# EAGLE schematic C9 (EAGLE 7.5.0)

## Sheet 1 of 4: Core1/4
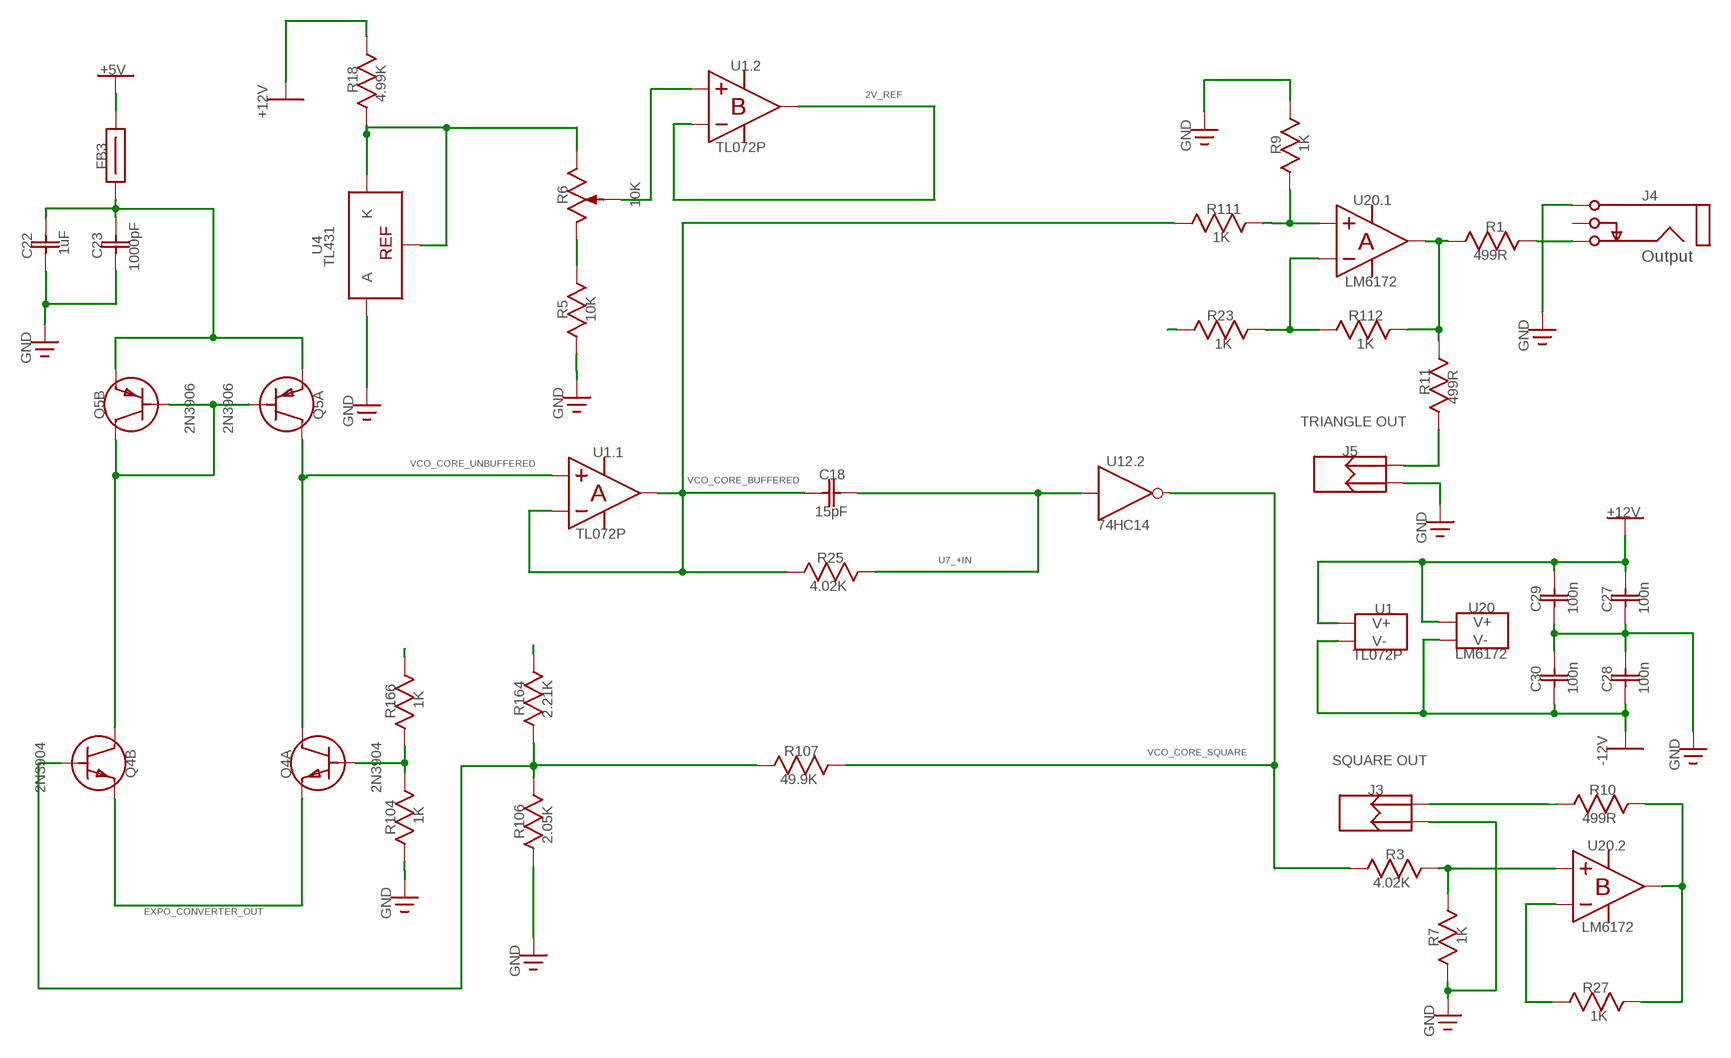
[diagram p0: schematic, sheet 1]

### Parts
C18  15pF  CAP100  [CAP-2.54/6.6X3]
C22  1uF  CAP100  [CAP-2.54/6.6X3]
C23  1000pF  CAP100  [CAP-2.54/6.6X3]
C27  100n  CAP100  [CAP-2.54/6.6X3]
C28  100n  CAP100  [CAP-2.54/6.6X3]
C29  100n  CAP100  [CAP-2.54/6.6X3]
C30  100n  CAP100  [CAP-2.54/6.6X3]
FB3  68R  2743001111  [FB-10.16/4.45X3.5]
J3  90131-0121  [HDR-2X1T/2.54X2.54/3X5]
J4  PJ302M_2  [PJ302M]
J5  90131-0121  [HDR-2X1T/2.54X2.54/3X5]
Q4A  2N3904  [TO-92]
Q4B  2N3904_11  [TO-92]
Q5A  2N3906_5  [TO-92]
Q5B  2N3906  [TO-92]
R1  499R  RES300  [RES-7.62/5.1X2.5]
R3  4.02K  RES300  [RES-7.62/5.1X2.5]
R5  10K  RES300  [RES-7.62/5.1X2.5]
R6  10K  3362P  [3362P]
R7  1K  RES300  [RES-7.62/5.1X2.5]
R9  1K  RES300  [RES-7.62/5.1X2.5]
R10  499R  RES300  [RES-7.62/5.1X2.5]
R11  499R  RES300  [RES-7.62/5.1X2.5]
R18  4.99K  RES300  [RES-7.62/5.1X2.5]
R23  1K  RES300  [RES-7.62/5.1X2.5]
R25  4.02K  RES300  [RES-7.62/5.1X2.5]
R27  1K  RES300  [RES-7.62/5.1X2.5]
R104  1K  RES300  [RES-7.62/5.1X2.5]
R106  2.05K  RES300  [RES-7.62/5.1X2.5]
R107  49.9K  RES300  [RES-7.62/5.1X2.5]
R111  1K  RES300  [RES-7.62/5.1X2.5]
R112  1K  RES300  [RES-7.62/5.1X2.5]
R164  2.21K  RES300  [RES-7.62/5.1X2.5]
R166  1K  RES300  [RES-7.62/5.1X2.5]
U1  TL072P  [DIP-8]
U4  TL431  [TO-92-100R]
U12  74HC14  [DIP-14]
U20  LM6172  [DIP-8]

### Nets
0V: C22.2 C23.2 C27.2 C28.1 C29.2 C30.1 J3.2 J4.1A(Sleeve) J4.1B(Sleeve) J5.2 R5.2(B) R7.1(A) R9.2(B) R104.1(A) R106.1(A) U4.2(A) ; supply symbol labelled GND ; also sheet 2,3,4
2V_REF: R23.1(A) R164.2(B) R166.2(B) U1.6(PART_2:IN-) U1.7(PART_2:OUT) ; also sheet 2,3
+5V: FB3.2 ; also sheet 3,4
+12V: C27.1 C29.1 R18.2(B) U1.8(VCC_AND_GND:V+) U20.8(VCC_AND_GND:V+) ; also sheet 2,4
-12V: C28.2 C30.2 U1.4(VCC_AND_GND:V-) U20.4(VCC_AND_GND:V-) ; also sheet 2,4
EXPO_CONVERTER_OUT: Q4A.1(E) Q4B.1(E) ; also sheet 2
Net_0: J4.3A(Tip) J4.3B(Tip) R1.2(B)
Net_1: R6.3(CW) R18.1(A) U4.1(K) U4.3(REF)
Net_5: R9.1(A) R111.2(B) U20.3(PART_1:IN+)
Net_7: R3.2(B) R7.2(B) U20.5(PART_2:IN+)
Net_8: J3.1 R10.1(A)
Net_16: R5.1(A) R6.1(CCW)
Net_19: R10.2(B) R27.2(B) U20.7(PART_2:OUT)
Net_21: R6.2(W) U1.5(PART_2:IN+)
Net_36: J5.1 R11.1(A)
Net_79: Q4B.3(C) Q5A.2(B) Q5B.2(B) Q5B.3(C)
Net_81: Q4A.2(B) R104.2(B) R166.1(A)
Net_85: Q4B.2(B) R106.2(B) R107.1(A) R164.1(A)
Net_101: R23.2(B) R112.1(A) U20.2(PART_1:IN-)
Net_103: C22.1 C23.1 FB3.1 Q5A.1(E) Q5B.1(E)
Net_178: R27.1(A) U20.6(PART_2:IN-)
PROCESSOR_IN: R1.1(A) R11.2(B) R112.2(B) U20.1(PART_1:OUT)
U7_+IN: C18.1 R25.2(B) U12.3(PART_2:A) ; also sheet 3
VCO_CORE_BUFFERED: C18.2 R25.1(A) R111.1(A) U1.1(PART_1:OUT) U1.2(PART_1:IN-)
VCO_CORE_SQUARE: R3.1(A) R107.2(B) U12.4(PART_2:Y)
VCO_CORE_UNBUFFERED: Q4A.3(C) Q5A.3(C) U1.3(PART_1:IN+) ; also sheet 3
Unconnected: J4.2A(Switch) J4.2B(Switch)

### Notes on the sheet
- +5V | U1.2
- R18 | 2V_REF
- B
- 4.99K
- +12V
- TL072P
- GND | R9 | 1K
- FB3
- R6 | J4
- 10K | U20.1
- R111
- 1K | A | R1
- 499R | Output
- 1uF | U4
- C22 | C23 | REF
- 1000pF | TL431
- LM6172
- R5 | 10K | R23 | R112
- 1K | 1K
- GND
- GND
- R11
- 499R
- Q5B | Q5A | GND | TRIANGLE OUT
- GND
- 2N3906 | 2N3906
- U1.1 | J5
- VCO_CORE_UNBUFFERED
- U12.2
- VCO_CORE_BUFFERED
- C18
- A
- 15pF
- 74HC14 | +12V
- TL072P
- GND
- U7_+IN
- R25
- 4.02K
- U1 | U20 | C29 | 100n | C27 | 100n
- TL072P | LM6172
- C30 | 100n | C28 | 100n
- 1K
- R166 | R164 | 2.21K
- VCO_CORE_SQUARE
- R107 | SQUARE OUT
- -12V
- 49.9K | GND
- Q4B | Q4A
- 2N3904 | 2N3904 | J3 | R10
- 499R
- 1K
- R104 | R106
- 2.05K
- U20.2
- R3
- 4.02K | B
- EXPO_CONVERTER_OUT
- GND | LM6172
- R7 | 1K
- GND
- R27
- 1K
- GND

## Sheet 2 of 4: Expo2/4
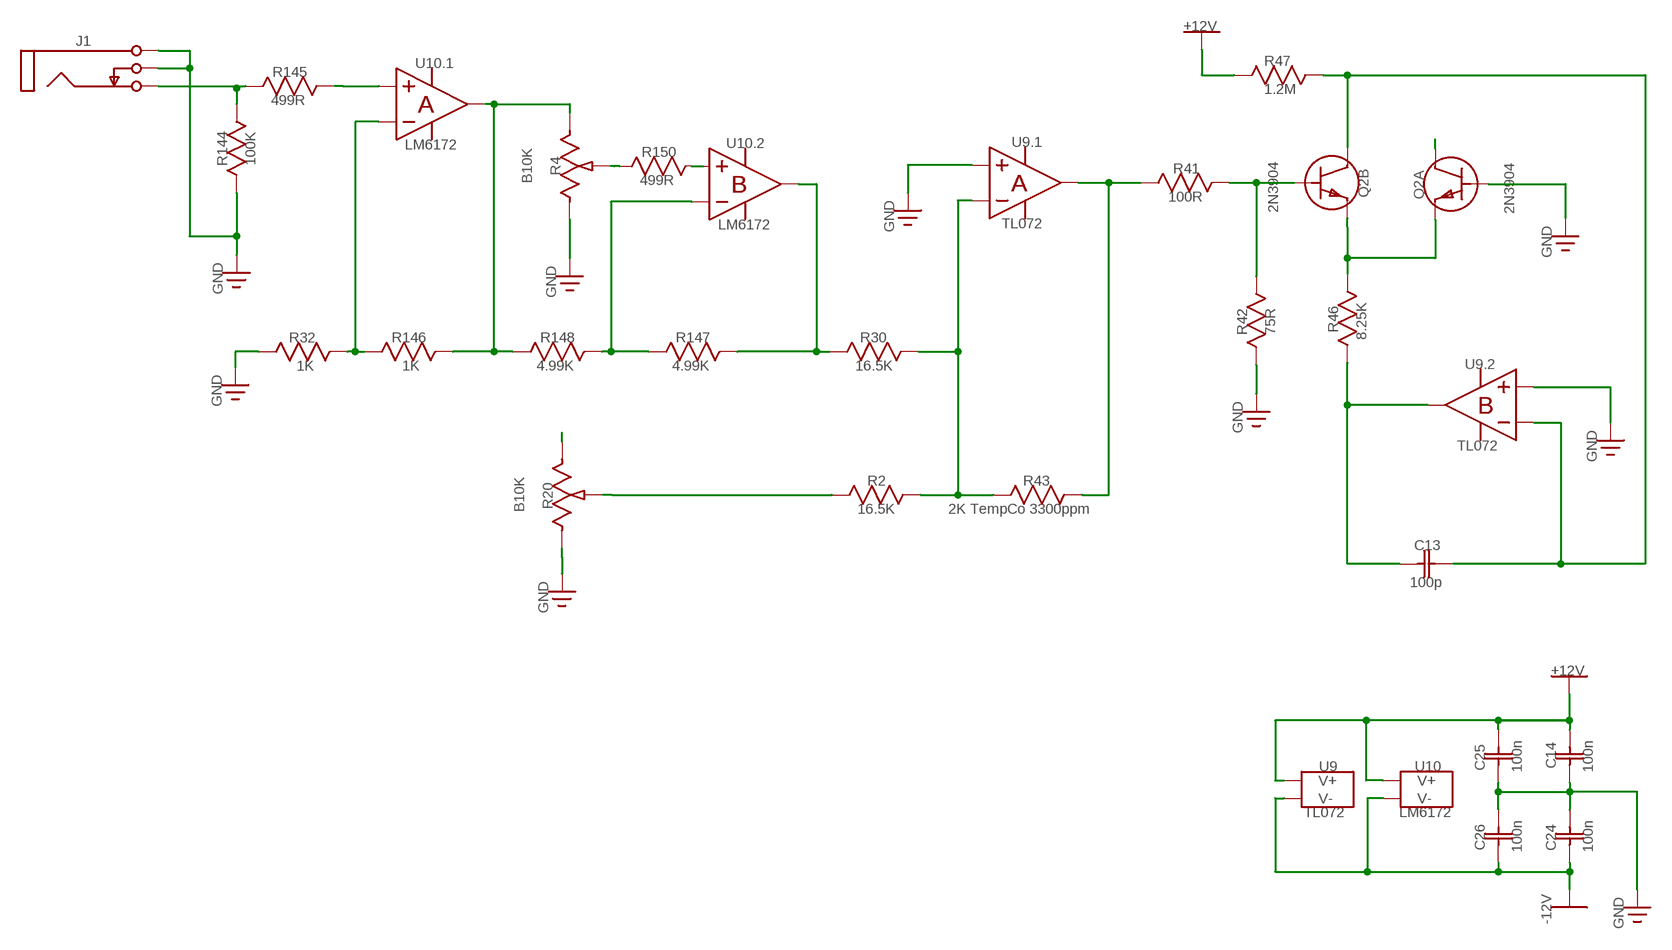
[diagram p1: schematic, sheet 2]

### Parts
C13  100p  CAP100  [CAP-2.54/6.6X3]
C14  100n  CAP100  [CAP-2.54/6.6X3]
C24  100n  CAP100  [CAP-2.54/6.6X3]
C25  100n  CAP100  [CAP-2.54/6.6X3]
C26  100n  CAP100  [CAP-2.54/6.6X3]
J1  PJ302M  [PJ302M]
Q2A  2N3904  [TO-92]
Q2B  2N3904_11  [TO-92]
R2  16.5K  RES300  [RES-7.62/5.1X2.5]
R4  B10K  ALPHA9H  [ALPHA9H]
R20  B10K  ALPHA9H  [ALPHA9H]
R30  16.5K  RES300  [RES-7.62/5.1X2.5]
R32  1K  RES300  [RES-7.62/5.1X2.5]
R41  100R  RES300  [RES-7.62/5.1X2.5]
R42  75R  RES300  [RES-7.62/5.1X2.5]
R43  2K TempCo 3300ppm  RES300  [RES-7.62/5.1X2.5]
R46  8.25K  RES300  [RES-7.62/5.1X2.5]
R47  1.2M  RES300  [RES-7.62/5.1X2.5]
R144  100K  RES300  [RES-7.62/5.1X2.5]
R145  499R  RES300  [RES-7.62/5.1X2.5]
R146  1K  RES300  [RES-7.62/5.1X2.5]
R147  4.99K  RES300  [RES-7.62/5.1X2.5]
R148  4.99K  RES300  [RES-7.62/5.1X2.5]
R150  499R  RES300  [RES-7.62/5.1X2.5]
U9  TL072  [DIP-8]
U10  LM6172  [DIP-8]

### Nets
0V: C14.2 C24.1 C25.2 C26.1 J1.1A(Sleeve) J1.1B(Sleeve) J1.2A(Switch) J1.2B(Switch) Q2A.2(B) R4.1(CCW) R20.1(CCW) R32.1(A) R42.1(A) R144.1(A) U9.3(PART_1:IN+) U9.5(PART_2:IN+) ; supply symbol labelled GND ; also sheet 1,3,4
2V_REF: R20.3(CW) ; also sheet 1,3
+12V: C14.1 C25.1 R47.2(B) U9.8(VCC_AND_GND:V+) U10.8(VCC_AND_GND:V+) ; also sheet 1,4
-12V: C24.2 C26.2 U9.4(VCC_AND_GND:V-) U10.4(VCC_AND_GND:V-) ; also sheet 1,4
EXPO_CONVERTER_OUT: Q2A.3(C) ; also sheet 1
Net_3: R2.1(A) R20.2(W)
Net_9: R4.2(W) R150.1(A)
Net_12: R4.3(CW) R146.2(B) R148.1(A) U10.1(PART_1:OUT)
Net_39: C13.1 Q2B.3(C) R47.1(A) U9.6(PART_2:IN-)
Net_45: Q2A.1(E) Q2B.1(E) R46.2(B)
Net_46: R2.2(B) R30.2(B) R43.1(A) U9.2(PART_1:IN-)
Net_48: R41.1(A) R43.2(B) U9.1(PART_1:OUT)
Net_49: Q2B.2(B) R41.2(B) R42.2(B)
Net_51: C13.2 R46.1(A) U9.7(PART_2:OUT)
Net_72: R145.2(B) U10.3(PART_1:IN+)
Net_83: J1.3A(Tip) J1.3B(Tip) R144.2(B) R145.1(A)
Net_110: R150.2(B) U10.5(PART_2:IN+)
Net_114: R32.2(B) R146.1(A) U10.2(PART_1:IN-)
Net_126: R147.1(A) R148.2(B) U10.6(PART_2:IN-)
VC_FM: R30.1(A) R147.2(B) U10.7(PART_2:OUT)

### Notes on the sheet
- +12V
- J1
- U10.1 | R47
- R145
- 1.2M
- 499R | A
- LM6172
- U10.2 | U9.1
- R150
- R144 | 100K
- R4 | 499R | B | A | R41
- B10K
- 100R
- Q2B | Q2A
- 2N3904 | 2N3904
- LM6172 | TL072
- GND
- GND
- GND | GND
- R42 | 75R | R46
- R32 | R146 | R148 | R147 | R30 | 8.25K
- 1K | 1K | 4.99K | 4.99K | 16.5K
- U9.2
- B
- GND
- GND
- TL072
- GND
- R2 | R43
- 16.5K | 2K TempCo 3300ppm
- B10K | R20
- C13
- 100p
- GND
- +12V
- U9 | U10 | C25 | 100n | C14 | 100n
- TL072 | LM6172
- C26 | 100n | C24 | 100n
- -12V
- GND

## Sheet 3 of 4: Sync3/4
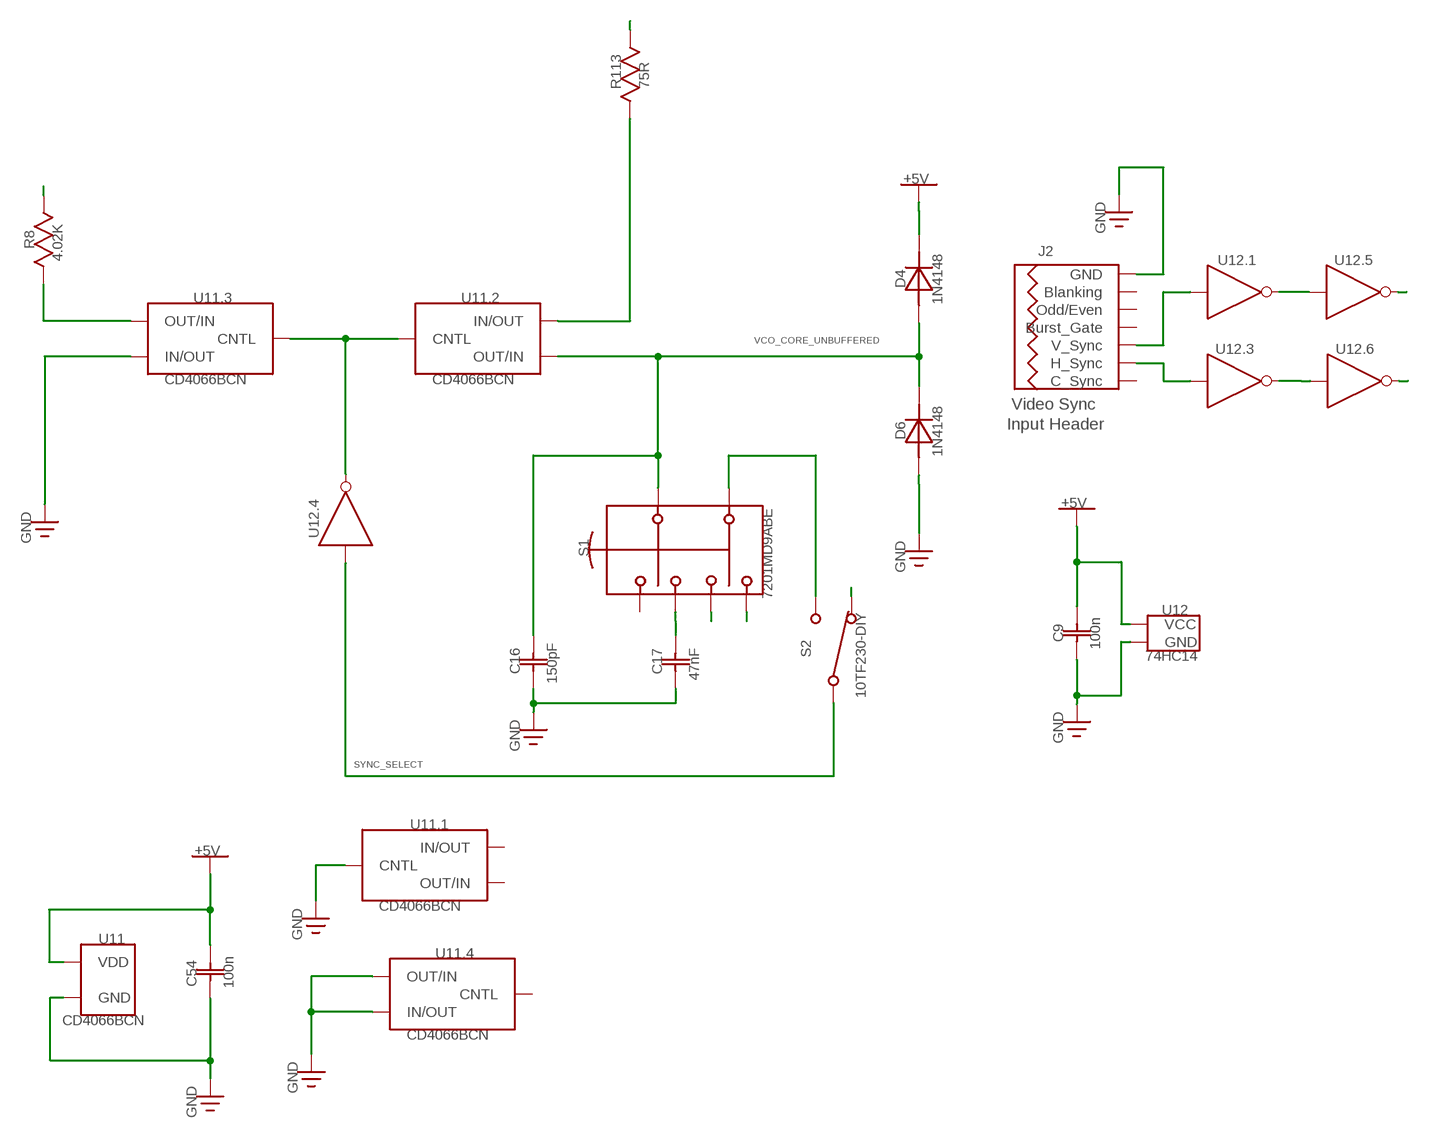
[diagram p2: schematic, sheet 3]

### Parts
C9  100n  CAP100  [CAP-2.54/6.6X3]
C16  150pF  CAP100  [CAP-2.54/6.6X3]
C17  47nF  CAP100  [CAP-2.54/6.6X3]
C54  100n  CAP100  [CAP-2.54/6.6X3]
D4  1N4148  [DO-35]
D6  1N4148  [DO-35]
J2  LZXSYNC14  [IDC14M]
R8  4.02K  RES300  [RES-7.62/5.1X2.5]
R113  75R  RES300  [RES-7.62/5.1X2.5]
S1  7201MD9ABE  [7201-A]
S2  10TF230-DIY  [7201-SPST]
U11  CD4066BCN  [DIP-14]

### Nets
0V: C9.2 C16.1 C17.1 C54.2 D6.2(A) J2.1(GND) J2.2(GND) U11.7(VCC_AND_GND:GND) U11.8(PART_3:IN/OUT) U11.10(PART_4:OUT/IN) U11.11(PART_4:IN/OUT) U11.13(PART_1:CNTL) U12.7(VCC_AND_GND:GND) ; supply symbol labelled GND ; also sheet 1,2,4
2V_REF: R113.2(B) ; also sheet 1,2
+5V: C9.1 C54.1 D4.1(K) S2.1(C3) S2.1B(C3) U11.14(VCC_AND_GND:VDD) U12.14(VCC_AND_GND:VCC) ; also sheet 1,4
_HSYNC: S1.4 S1.4B U12.12(PART_6:Y)
_VSYNC: S1.6 S1.6B U12.10(PART_5:Y)
Net_2: U12.6(PART_3:Y) U12.13(PART_6:A)
Net_4: J2.11(H_Sync) J2.12(H_Sync) U12.5(PART_3:A)
Net_6: R8.1(A) U11.9(PART_3:OUT/IN)
Net_56: J2.9(V_Sync) J2.10(V_Sync) U12.1(PART_1:A)
Net_58: U12.2(PART_1:Y) U12.11(PART_5:A)
Net_59: C17.2 S1.3 S1.3B
Net_61: S1.5(COMM) S1.5B(COMM) S2.3(C2) S2.3B(C2)
Net_62: U11.5(PART_2:CNTL) U11.6(PART_3:CNTL) U12.8(PART_4:Y)
SYNC_SELECT: S2.2(C1) S2.2B(C1) U12.9(PART_4:A)
SYNC_SWITCH_REFERENCE: R113.1(A) U11.4(PART_2:IN/OUT)
U7_+IN: R8.2(B) ; also sheet 1
VCO_CORE_UNBUFFERED: C16.2 D4.2(A) D6.1(K) S1.2(COMM) S1.2B(COMM) U11.3(PART_2:OUT/IN) ; also sheet 1
Unconnected: J2.3(Blanking) J2.4(Blanking) J2.5(Odd/Even) J2.6(Odd/Even) J2.7(Burst_Gate) J2.8(Burst_Gate) J2.13(C_Sync) J2.14(C_Sync) S1.1 S1.1B U11.1(PART_1:IN/OUT) U11.2(PART_1:OUT/IN) U11.12(PART_4:CNTL)

### Notes on the sheet
- R113 | 75R
- +5V
- GND
- R8
- J2
- 4.02K | U12.1 | U12.5
- D4
- U11.3 | U11.2 | 1N4148
- VCO_CORE_UNBUFFERED
- U12.3 | U12.6
- CD4066BCN | CD4066BCN
- Video Sync
- Input Header
- D6
- 1N4148
- +5V
- U12.4
- GND
- S1
- GND
- 7201MD9ABE
- U12
- C9
- 100n | 74HC14
- S2
- C16 | C17
- 150pF | 47nF
- 10TF230-DIY
- GND
- GND
- SYNC_SELECT
- U11.1
- +5V
- CD4066BCN
- GND
- U11
- U11.4
- C54 | 100n
- CD4066BCN
- CD4066BCN
- GND
- GND

## Sheet 4 of 4: Power4/4
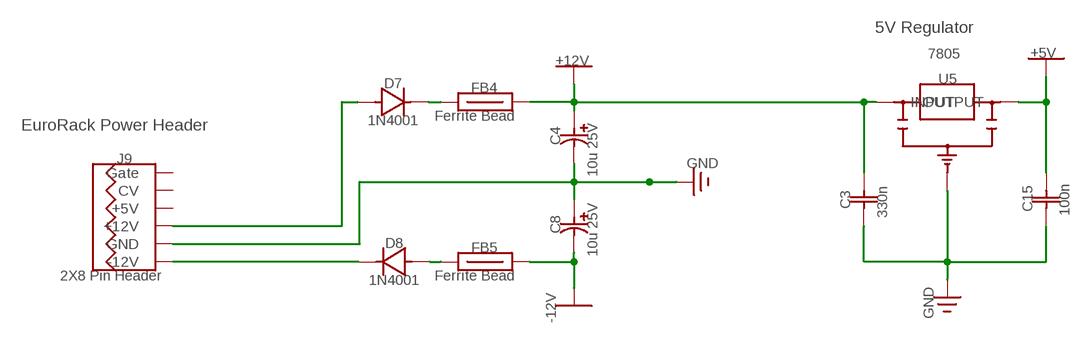
[diagram p3: schematic, sheet 4]

### Parts
C3  330n  CAP100  [CAP-2.54/6.6X3]
C4  10u 25V  EC80-5  [CAPPR-2/5.08]
C8  10u 25V  EC80-5  [CAPPR-2/5.08]
C15  100n  CAP100  [CAP-2.54/6.6X3]
D7  1N4001  [DO-41]
D8  1N4001  [DO-41]
FB4  68R  FERRITE_BEAD  [FB-10.16/4.45X3.5]
FB5  68R  FERRITE_BEAD  [FB-10.16/4.45X3.5]
J9  2X8_PIN_HEADER  [IDC16M]
U5  7805  [TO-220H]

### Nets
0V: C3.2 C4.2(MINUS) C8.1(PLUS) C15.2 J9.3(GND) J9.4(GND) J9.5(GND) U5.2(GND) ; supply symbol labelled GND ; also sheet 1,2,3
+5V: C15.1 U5.3(OUTPUT) ; also sheet 1,3
+12V: C3.1 C4.1(PLUS) FB4.2 U5.1(INPUT) ; also sheet 1,2
-12V: C8.2(MINUS) FB5.2 ; also sheet 1,2
Net_13: D8.2(A) FB5.1
Net_17: D7.1(K) FB4.1
Net_18: D8.1(K) J9.1(-12V) J9.2(-12V)
Net_20: D7.2(A) J9.9(+12V) J9.10(+12V)
Unconnected: J9.11(+5V) J9.12(+5V) J9.13(CV) J9.14(CV) J9.15(Gate) J9.16(Gate)

### Notes on the sheet
- 5V Regulator
- 7805
- +5V
- +12V
- U5
- D7
- FB4
- Ferrite Bead
- EuroRack Power Header | 1N4001
- C4
- J9
- GND
- 10u 25V
- C3 | C15
- 330n | 100n
- C8
- D8
- FB5 | 10u 25V
- 2X8 Pin Header | Ferrite Bead
- 1N4001
- GND
- -12V

## Library data of the parts
C3 C9 C14-C18 C22-C30 C54 = common:CAP100; VALUE: 100p
C4 C8 = common:EC80-5
C13 = common:CAP100
D4 D6 = common:1N4148; DATASHEET: http://datasheets.diptrace.com\fairchild\1N4148.pdf; MANUFACTURER: Fairchild
D7 D8 = common:1N4001
FB3 = common:2743001111; MANUFACTURER: Fair-Rite
FB4 FB5 = common:FERRITE_BEAD; MANUFACTURER: Fair-Rite
J1 = common:PJ302M; DATASHEET: http://www.thonk.co.uk/shop/pj302m/
J2 = common:LZXSYNC14
J3 J5 = common:90131-0121; DATASHEET: http://datasheets.diptrace.com/con_headers/901310126_sd.pdf; MANUFACTURER: Molex
J4 = common:PJ302M_2; DATASHEET: http://www.thonk.co.uk/shop/pj302m/
J9 = common:2X8_PIN_HEADER
Q2A Q4A = common:2N3904
Q2B Q4B = common:2N3904_11
Q5A = common:2N3906_5
Q5B = common:2N3906
R1 R2 R5 R7 R9-R11 R18 R23 R27 R30 R32 R41-R43 R46 R47 R104 R106 R107 R111-R113 R144-R148 R150 R164 R166 = common:RES300; VALUE: 4.02K
R3 R8 R25 = common:RES300
R4 R20 = common:ALPHA9H; DATASHEET: http://www.thonk.co.uk/shop/alpha-9mm-pots/; MANUFACTURER: Alpha
R6 = common:3362P; DATASHEET: http://datasheets.diptrace.com/potentiometers/bourns_trimpot_catalog.pdf; MANUFACTURER: Bourns
S1 = common:7201MD9ABE; DATASHEET: http://datasheets.diptrace.com/switches/7000_series.pdf; MANUFACTURER: C&K
S2 = common:10TF230-DIY
U1 = common:TL072P; DATASHEET: http://datasheets.diptrace.com\ti\TL07x.pdf; MANUFACTURER: Texas Instruments
U4 = common:TL431; DATASHEET: http://datasheets.diptrace.com\st_micro\CD00000986.pdf; MANUFACTURER: ST Microelectronics
U5 = common:7805; MANUFACTURER: Atmel
U9 = common:TL072; DATASHEET: http://www.ti.com/lit/gpn/lm6172; MANUFACTURER: Texas Instruments
U10 U20 = common:LM6172; DATASHEET: http://www.ti.com/lit/gpn/lm6172; MANUFACTURER: Texas Instruments
U11 = common:CD4066BCN; DATASHEET: http://datasheets.diptrace.com/fairchild/CD4066BC.pdf; MANUFACTURER: Fairchild
U12 = common:74HC14; MANUFACTURER: National Semiconductor